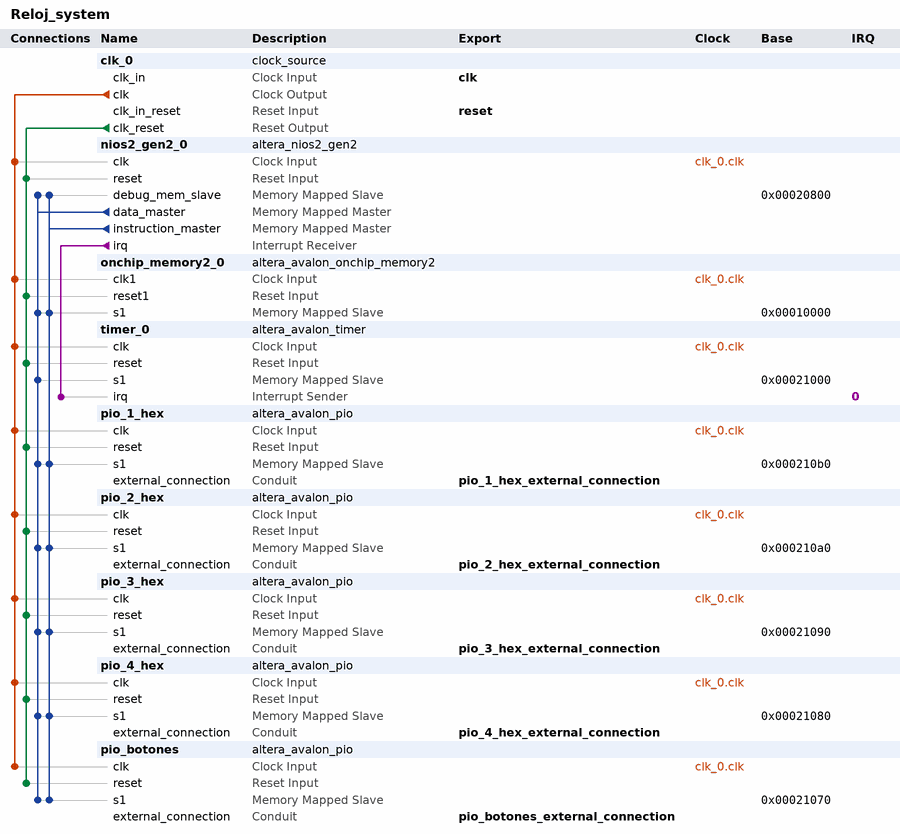
[diagram p0: system contents]
# Platform Designer (Qsys) system Reloj_system, Cyclone V 5CSEMA5F31C6
# Parameters at their usual value, and those the tool derives, are not listed.
package require -exact qsys 17.1
create_system Reloj_system
set_project_property DEVICE_FAMILY {Cyclone V}
set_project_property DEVICE 5CSEMA5F31C6

add_instance clk_0 clock_source 17.1
set_instance_parameter_value clk_0 clockFrequency 50000000

add_instance nios2_gen2_0 altera_nios2_gen2 17.1
set_instance_parameter_value nios2_gen2_0 dcache_size 2048
set_instance_parameter_value nios2_gen2_0 exceptionSlave onchip_memory2_0.s1
set_instance_parameter_value nios2_gen2_0 icache_size 4096
set_instance_parameter_value nios2_gen2_0 impl Tiny
set_instance_parameter_value nios2_gen2_0 resetSlave onchip_memory2_0.s1

add_instance onchip_memory2_0 altera_avalon_onchip_memory2 17.1
set_instance_parameter_value onchip_memory2_0 dataWidth 32
set_instance_parameter_value onchip_memory2_0 dualPort false
set_instance_parameter_value onchip_memory2_0 initMemContent true
set_instance_parameter_value onchip_memory2_0 initializationFileName onchip_mem.hex
set_instance_parameter_value onchip_memory2_0 memorySize 65536

add_instance timer_0 altera_avalon_timer 17.1
set_instance_parameter_value timer_0 period 1
set_instance_parameter_value timer_0 periodUnits MSEC

add_instance pio_1_hex altera_avalon_pio 17.1
set_instance_parameter_value pio_1_hex direction Output
set_instance_parameter_value pio_1_hex width 7

add_instance pio_2_hex altera_avalon_pio 17.1
set_instance_parameter_value pio_2_hex direction Output
set_instance_parameter_value pio_2_hex width 7

add_instance pio_3_hex altera_avalon_pio 17.1
set_instance_parameter_value pio_3_hex direction Output
set_instance_parameter_value pio_3_hex width 7

add_instance pio_4_hex altera_avalon_pio 17.1
set_instance_parameter_value pio_4_hex direction Output
set_instance_parameter_value pio_4_hex width 7

add_instance pio_botones altera_avalon_pio 17.1
set_instance_parameter_value pio_botones direction Input
set_instance_parameter_value pio_botones width 3

# connections
add_connection clk_0.clk nios2_gen2_0.clk clock
add_connection clk_0.clk onchip_memory2_0.clk1 clock
add_connection clk_0.clk pio_1_hex.clk clock
add_connection clk_0.clk pio_2_hex.clk clock
add_connection clk_0.clk pio_3_hex.clk clock
add_connection clk_0.clk pio_4_hex.clk clock
add_connection clk_0.clk pio_botones.clk clock
add_connection clk_0.clk timer_0.clk clock
add_connection clk_0.clk_reset nios2_gen2_0.reset reset
add_connection clk_0.clk_reset onchip_memory2_0.reset1 reset
add_connection clk_0.clk_reset pio_1_hex.reset reset
add_connection clk_0.clk_reset pio_2_hex.reset reset
add_connection clk_0.clk_reset pio_3_hex.reset reset
add_connection clk_0.clk_reset pio_4_hex.reset reset
add_connection clk_0.clk_reset pio_botones.reset reset
add_connection clk_0.clk_reset timer_0.reset reset
add_connection nios2_gen2_0.data_master nios2_gen2_0.debug_mem_slave avalon
set_connection_parameter_value nios2_gen2_0.data_master/nios2_gen2_0.debug_mem_slave baseAddress 0x00020800
add_connection nios2_gen2_0.data_master onchip_memory2_0.s1 avalon
set_connection_parameter_value nios2_gen2_0.data_master/onchip_memory2_0.s1 baseAddress 0x00010000
add_connection nios2_gen2_0.data_master pio_1_hex.s1 avalon
set_connection_parameter_value nios2_gen2_0.data_master/pio_1_hex.s1 baseAddress 0x000210b0
add_connection nios2_gen2_0.data_master pio_2_hex.s1 avalon
set_connection_parameter_value nios2_gen2_0.data_master/pio_2_hex.s1 baseAddress 0x000210a0
add_connection nios2_gen2_0.data_master pio_3_hex.s1 avalon
set_connection_parameter_value nios2_gen2_0.data_master/pio_3_hex.s1 baseAddress 0x00021090
add_connection nios2_gen2_0.data_master pio_4_hex.s1 avalon
set_connection_parameter_value nios2_gen2_0.data_master/pio_4_hex.s1 baseAddress 0x00021080
add_connection nios2_gen2_0.data_master pio_botones.s1 avalon
set_connection_parameter_value nios2_gen2_0.data_master/pio_botones.s1 baseAddress 0x00021070
add_connection nios2_gen2_0.data_master timer_0.s1 avalon
set_connection_parameter_value nios2_gen2_0.data_master/timer_0.s1 baseAddress 0x00021000
add_connection nios2_gen2_0.instruction_master nios2_gen2_0.debug_mem_slave avalon
set_connection_parameter_value nios2_gen2_0.instruction_master/nios2_gen2_0.debug_mem_slave baseAddress 0x00020800
add_connection nios2_gen2_0.instruction_master onchip_memory2_0.s1 avalon
set_connection_parameter_value nios2_gen2_0.instruction_master/onchip_memory2_0.s1 baseAddress 0x00010000
add_connection nios2_gen2_0.instruction_master pio_1_hex.s1 avalon
set_connection_parameter_value nios2_gen2_0.instruction_master/pio_1_hex.s1 baseAddress 0x000210b0
add_connection nios2_gen2_0.instruction_master pio_2_hex.s1 avalon
set_connection_parameter_value nios2_gen2_0.instruction_master/pio_2_hex.s1 baseAddress 0x000210a0
add_connection nios2_gen2_0.instruction_master pio_3_hex.s1 avalon
set_connection_parameter_value nios2_gen2_0.instruction_master/pio_3_hex.s1 baseAddress 0x00021090
add_connection nios2_gen2_0.instruction_master pio_4_hex.s1 avalon
set_connection_parameter_value nios2_gen2_0.instruction_master/pio_4_hex.s1 baseAddress 0x00021080
add_connection nios2_gen2_0.instruction_master pio_botones.s1 avalon
set_connection_parameter_value nios2_gen2_0.instruction_master/pio_botones.s1 baseAddress 0x00021070
add_connection nios2_gen2_0.irq timer_0.irq interrupt
set_connection_parameter_value nios2_gen2_0.irq/timer_0.irq irqNumber 0

# exported interfaces
add_interface clk clock sink
set_interface_property clk EXPORT_OF clk_0.clk_in
add_interface pio_1_hex_external_connection conduit end
set_interface_property pio_1_hex_external_connection EXPORT_OF pio_1_hex.external_connection
add_interface pio_2_hex_external_connection conduit end
set_interface_property pio_2_hex_external_connection EXPORT_OF pio_2_hex.external_connection
add_interface pio_3_hex_external_connection conduit end
set_interface_property pio_3_hex_external_connection EXPORT_OF pio_3_hex.external_connection
add_interface pio_4_hex_external_connection conduit end
set_interface_property pio_4_hex_external_connection EXPORT_OF pio_4_hex.external_connection
add_interface pio_botones_external_connection conduit end
set_interface_property pio_botones_external_connection EXPORT_OF pio_botones.external_connection
add_interface reset reset sink
set_interface_property reset EXPORT_OF clk_0.clk_in_reset

set_interconnect_requirement {$system} qsys_mm.clockCrossingAdapter HANDSHAKE
set_interconnect_requirement {$system} qsys_mm.enableEccProtection FALSE
set_interconnect_requirement {$system} qsys_mm.insertDefaultSlave FALSE
set_interconnect_requirement {$system} qsys_mm.maxAdditionalLatency 1

save_system Reloj_system.qsys
